# Altium schematic sheet Схема_узел_поворотников.SchDoc: we
size A4; ApprovedBy: wdwd; CheckedBy: 1; Author: 2; CompanyName: 3; DrawnBy: 4; Engineer: 5; Organization: 6; Address1: 7; Address2: 8; Address3: 9; Address4: 0
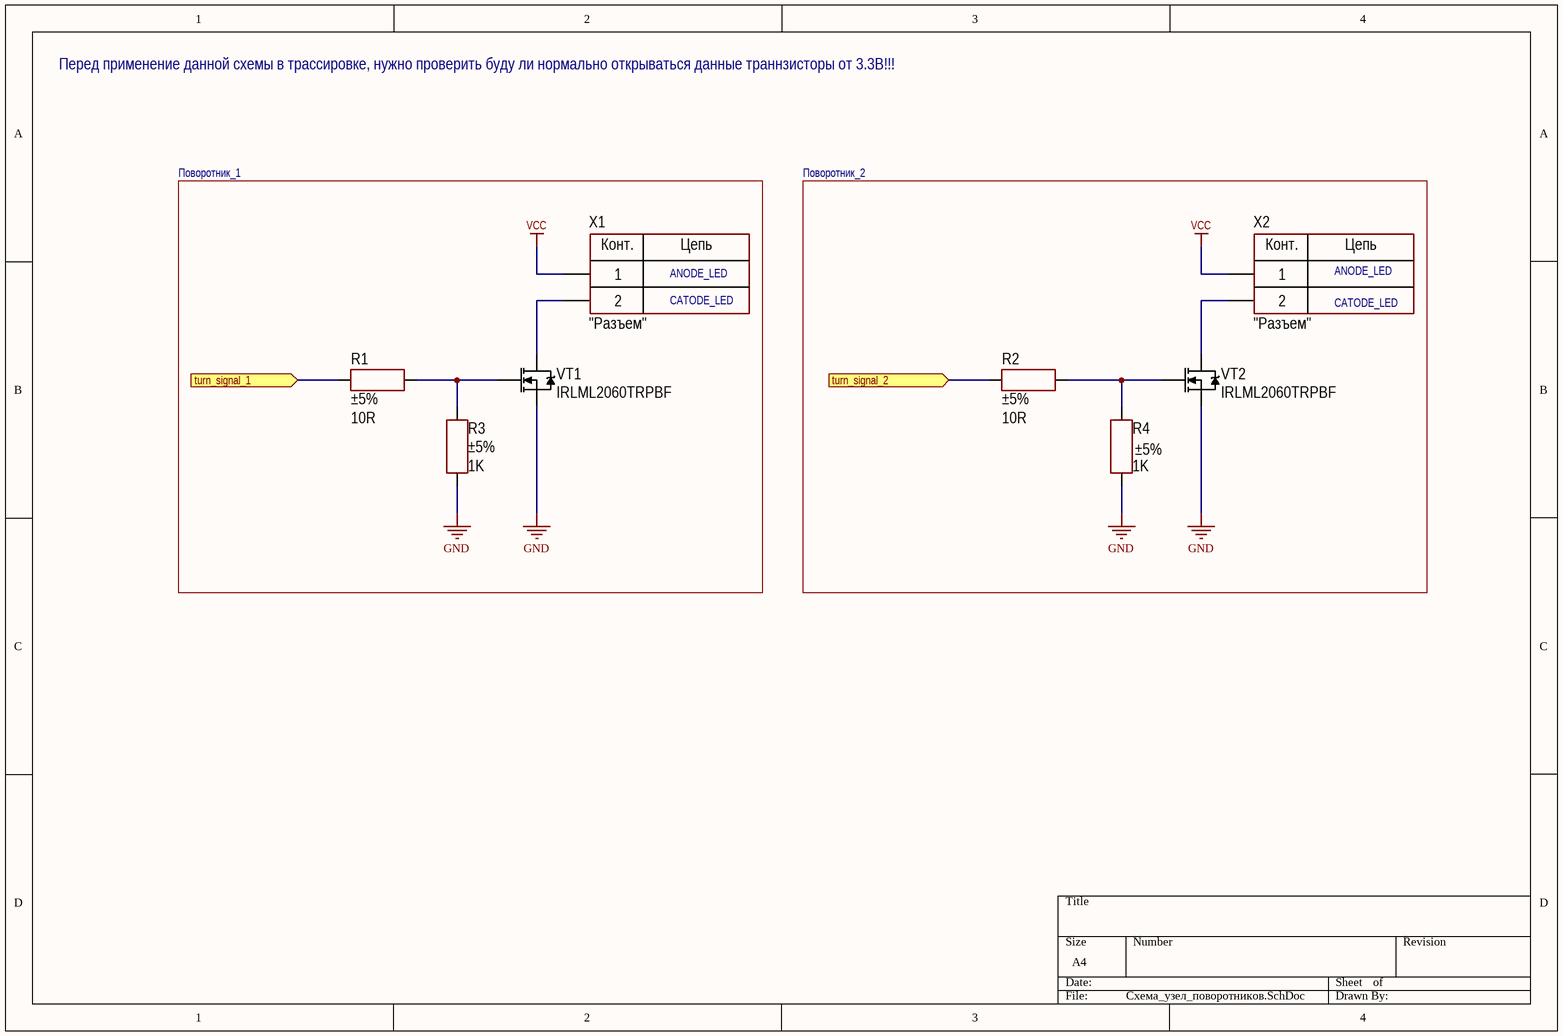
[diagram p0: Схема_узел_поворотников.SchDoc]

## Parts
R1  value 10R  Tolerance: ±5%  [RES: 0603]
R2  value 10R  Tolerance: ±5%  [RES: 0603]
R3  value 1K  Tolerance: ±5%  [RES: 0603]
R4  value 1K  Tolerance: ±5%  [RES: 0603]
VT1  PartNumber: IRLML2060TRPBF  [SOT23]
VT2  PartNumber: IRLML2060TRPBF  [SOT23]
X1  CommentText: "Разъем"  [CON: DG350-3.5-02P]
X2  CommentText: "Разъем"  [CON: DG350-3.5-02P]

## Ports
turn_signal_1 (in), turn_signal_2 (in)

## Nets
GND: R3.1 R4.1 VT1.2(S) VT2.2(S)
VCC: X1.1 X2.1
turn_signal_1: R1.1 ; port turn_signal_1
turn_signal_2: R2.1 ; port turn_signal_2
NetR1_2: R1.2 R3.2 VT1.1(G)
NetR2_2: R2.2 R4.2 VT2.1(G)
NetVT1_3: VT1.3(D) X1.2
NetVT2_3: VT2.3(D) X2.2

## Notes on the sheet
- Перед применение данной схемы в трассировке, нужно проверить буду ли нормально открываться данные траннзисторы от 3.3В!!!
- Поворотник_1
- Поворотник_2
- ANODE_LED
- CATODE_LED
- (in symbol Connector_terminal_2pin) Конт.; Цепь

## Library data of the parts
R1 R2 = Resistor_0603: Manufacturer: Yageo; PartNumber: RC0603JR-07100RL; ValueManufacturerPartNumber: Resistor film, 10R, ±5%, 0603, 0.1W, -55...+125°C; TypeResistor: Resistor film; Power: 0.1W; Package: 0603; HelpURL: https://www.digikey.com/product-detail/en/yageo/RC0603JR-07100RL/311-100GRCT-ND/729644; Temperature: -55...+125°C
R3 R4 = Resistor_0603: Manufacturer: Yageo; PartNumber: RC0603JR-07100RL; ValueManufacturerPartNumber: Resistor film, 1K, ±5%, 0603, 0.1W, -55...+125°C; TypeResistor: Resistor film; Power: 0.1W; Package: 0603; HelpURL: https://www.digikey.com/product-detail/en/yageo/RC0603JR-07100RL/311-100GRCT-ND/729644; Temperature: -55...+125°C
VT1 VT2 = MOSFET_N_132: Manufacturer: Infineon Technologies; ValueManufacturerPartNumber: MOSFET N-channel transistor, 80V, 7A, 9.1nC, 2.5W, 34mOhm, 756pF, 8-TDSON, -55...+150°C; TypeTransistor: MOSFET N-channel transistor; VoltageDS: 80V; CurrentDS: 7A; RDS: 34mOhm; GateCharge: 9.1nC; InputCapacitor: 756pF; MaxPower: 2.5W; Package: 8-TDSON; HelpURL: https://www.digikey.com/product-detail/en/infineon-technologies/BSC340N08NS3GATMA1/BSC340N08NS3GATMA1TR-ND/2080655; Temperature: -55...+150°C
X1 X2 = Connector_terminal_2pin: Manufacturer: Degson; ValueManufacturerPartNumber: Terminal connector, 2pin, 3.5mm, 300VAC, 10A; PartNumber: DG350-3.5-02P-14; TypeConnector: Terminal connector; VoltageMax: 300VAC; Pitch: 3.5mm; CurrentMax: 10A; Multichannel: 2pin; HelpURL: https://www.chipdip.ru/product/dg350-3.5-02p-12